# Altium project Quasar ARM.PrjPcb
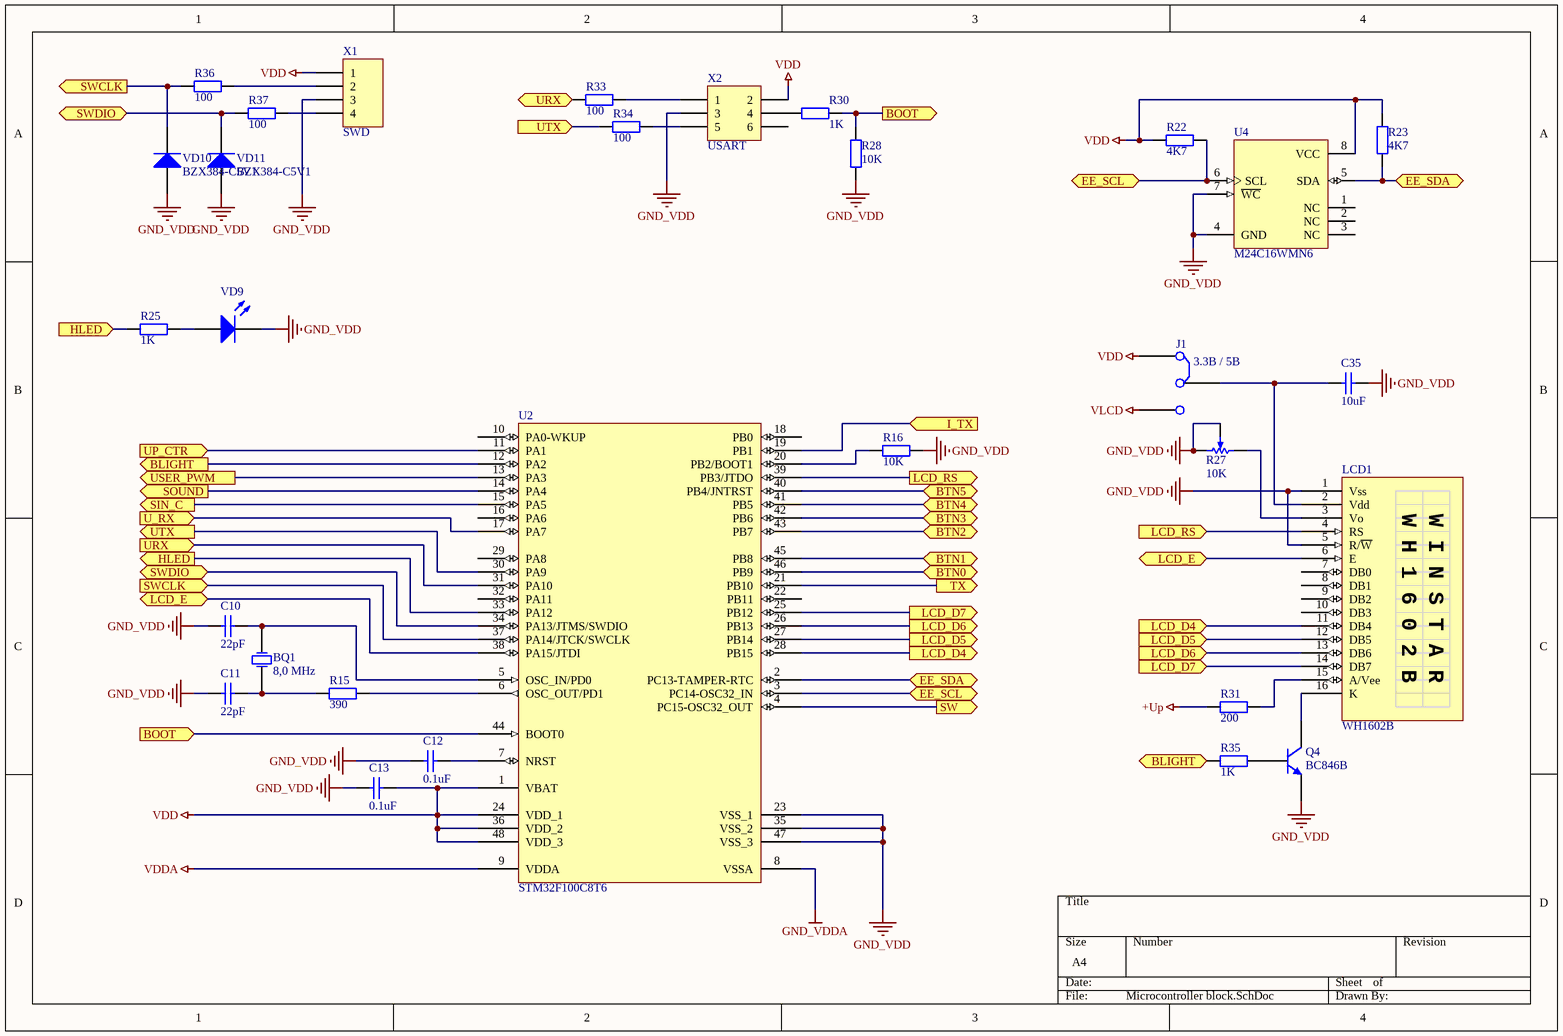
[diagram p0: Microcontroller block.SchDoc]
7 sheets, 157 parts. Net scope: flat (ports and power ports of the same name join across sheets).
Board files: pechatka.PcbDoc, pechatka_100x60.PcbDoc, pechatka_100x60_fabric.PcbDoc, pechatka_100x60_fabric_v2.PcbDoc, Integrator.PcbDoc, CoilOrganiser.PcbDoc
Sheets:
  Microcontroller block.SchDoc
  Power block.SchDoc
  Transmitter.SchDoc
  SoundBlock.SchDoc
  ReceiverBlock.SchDoc
  Keyboard_on_board.SchDoc
  Integrator.SchDoc

## Sheet Microcontroller block.SchDoc
size A4

### Parts
BQ1  8,0 MHz  [HC-49/U3H (low profile)]
C10  22pF  [0805]
C11  22pF  [0805]
C12  0.1uF  [0805]
C13  0.1uF  [1206_SMD_Capacitor]
C35  10uF  [1206_SMD_Capacitor]
J1  3.3В / 5В  [1206_SMD_JUMPER SELECTOR]
LCD1  WH1602B  [WS1602B-3]
Q4  BC846B  [SOT23_N]
R15  390  [1206_SMD_Resistor]
R16  10K  [1206_SMD_Resistor]
R22  4K7  [1206_SMD_Resistor]
R23  4K7  [1206_SMD_Resistor]
R25  1K  [1206_SMD_Resistor]
R27  10K  [3362P]
R28  10K  [1206_SMD_Resistor]
R30  1K  [1206_SMD_Resistor]
R31  200  [1206_SMD_Resistor]
R33  100  [1206_SMD_Resistor]
R34  100  [1206_SMD_Resistor]
R35  1K  [1206_SMD_Resistor]
R36  100  [1206_SMD_Resistor]
R37  100  [1206_SMD_Resistor]
U2  STM32F100C8T6  [LQFP-48_L]
U4  M24C16WMN6  [SO-8]
VD9  LED0  [1206_SMD_Resistor]  (value not drawn)
VD10  BZX384-C5V1  [SOD323]
VD11  BZX384-C5V1  [SOD323]
X1  SWD  [HDR1X4]
X2  USART  [HDR2X3]

### Ports
BLIGHT (in), BLIGHT (out), BOOT (in), BOOT (out), BTN0 (bidir), BTN1 (bidir), BTN2 (bidir), BTN3 (bidir), BTN4 (bidir), BTN5 (bidir), EE_SCL (bidir), EE_SDA (bidir), HLED (in), HLED (out), I_TX (in), LCD_D4 (in), LCD_D4 (out), LCD_D5 (in), LCD_D5 (out), LCD_D6 (in), LCD_D6 (out), LCD_D7 (in), LCD_D7 (out), LCD_E, LCD_E (bidir), LCD_RS (in), LCD_RS (out), SIN_C (out), SOUND (out), SW (out), SWCLK (in), SWCLK (out), SWDIO (bidir), TX (out), U_RX (in), UP_CTR (in), URX (in), URX (out), USER_PWM (out), UTX (in), UTX (out)

### Nets
+Up: R31.1
GND_VDD: C10.1 C11.1 C12.1 C13.1 C35.2 LCD1.1(Vss) LCD1.5(R/~{W}) Q4.2(E) R16.2 R27.1 R27.2 R28.1 U2.23(VSS_1) U2.35(VSS_2) U2.47(VSS_3) U4.4(GND) U4.7(~{WC}) VD9.2(K) VD10.1(A) VD11.1(A) X1.3 X2.3
GND_VDDA: U2.8(VSSA)
VDD: C13.2 J1.1 R22.1 R23.2 U2.1(VBAT) U2.24(VDD_1) U2.36(VDD_2) U2.48(VDD_3) U4.8(VCC) X1.1 X2.2
VDDA: U2.9(VDDA)
VLCD: J1.2
BTN0: U2.46(PB9) ; port BTN0
BTN1: U2.45(PB8) ; port BTN1
BTN2: U2.43(PB7) ; port BTN2
BTN3: U2.42(PB6) ; port BTN3
BTN4: U2.41(PB5) ; port BTN4
BTN5: U2.40(PB4/JNTRST) ; port BTN5
I_TX: U2.19(PB1) ; port I_TX
SIN_C: U2.15(PA5) ; port SIN_C
TX: U2.21(PB10) ; port TX
U_RX: U2.17(PA7) ; port U_RX
NetBQ1_1: BQ1.1(OSC1) C11.2 R15.1
NetBQ1_2: BQ1.2(OSC2) C10.2 U2.5(OSC_IN/PD0)
NetC12_2: C12.2 U2.7(NRST)
NetC19_2: U2.11(PA1) ; port UP_CTR
NetC31_1: U2.14(PA4) ; port SOUND
NetC35_1: C35.1 J1.0 LCD1.2(Vdd)
NetLCD1_3: LCD1.3(Vo) R27.3
NetLCD1_4: LCD1.4(RS) U2.39(PB3/JTDO) ; port LCD_RS
NetLCD1_6: LCD1.6(E) U2.38(PA15/JTDI) ; port LCD_E
NetLCD1_11: LCD1.11(DB4) U2.28(PB15) ; port LCD_D4
NetLCD1_12: LCD1.12(DB5) U2.27(PB14) ; port LCD_D5
NetLCD1_13: LCD1.13(DB6) U2.26(PB13) ; port LCD_D6
NetLCD1_14: LCD1.14(DB7) U2.25(PB12) ; port LCD_D7
NetLCD1_15: LCD1.15(A/Vee) R31.2
NetLCD1_16: LCD1.16(K) Q4.3(C)
NetQ4_1: Q4.1(B) R35.2
NetR15_2: R15.2 U2.6(OSC_OUT/PD1)
NetR16_1: R16.1 U2.20(PB2/BOOT1)
NetR22_2: R22.2 U2.3(PC14-OSC32_IN) U4.6(SCL) ; port EE_SCL
NetR23_1: R23.1 U2.2(PC13-TAMPER-RTC) U4.5(SDA) ; port EE_SDA
NetR25_1: R25.1 VD9.1(A)
NetR25_2: R25.2 U2.33(PA12) ; port HLED
NetR28_2: R28.2 R30.2 U2.44(BOOT0) ; port BOOT
NetR30_1: R30.1 X2.4
NetR33_1: R33.1 U2.31(PA10) ; port URX
NetR33_2: R33.2 X2.1
NetR34_1: R34.1 U2.30(PA9) ; port UTX
NetR34_2: R34.2 X2.5
NetR35_1: R35.1 U2.12(PA2) ; port BLIGHT
NetR36_1: R36.1 U2.37(PA14/JTCK/SWCLK) VD10.3(K) ; port SWCLK
NetR36_2: R36.2 X1.2
NetR37_1: R37.1 U2.34(PA13/JTMS/SWDIO) VD11.3(K) ; port SWDIO
NetR37_2: R37.2 X1.4
NetR47_1: U2.13(PA3) ; port USER_PWM
NetU2_4: U2.4(PC15-OSC32_OUT) ; port SW

Not connected (* = marked no-connect by the designer): LCD1 7(DB0) 8(DB1) 9(DB2) 10(DB3); U2 10(PA0-WKUP) 16(PA6) 18(PB0) 22(PB11) 29(PA8) 32(PA11); U4 1(NC) 2(NC) 3(NC); X2 6

### Notes on the sheet
- (in symbol WH1602B) W H 1 6 0 2 B; W I N S T A R

### Library data of the parts
BQ1 = XTAL: Crystal Oscillator; Published: 8-Jun-2000; LatestRevisionDate: 17-Jul-2002; LatestRevisionNote: Re-released for DXP Platform.; PackageReference: R38; Publisher: Altium Limited; PackageDescription: Crystal, Thru-Hole; 2 Leads; Body 3.1 x 8.2 mm (Dia.xH); Frequence: 8,0 MHz
C10-C13 C35 = Capacitor SMD: Capacitor; Published: 8-Jun-2000; LatestRevisionDate: 17-Jul-2002; LatestRevisionNote: Re-released for DXP Platform.; PackageReference: RAD-0.3; Publisher: Altium Limited
  C10 C11: Value: 22pF
  C12 C13: Value: 0.1uF
  C35: Value: 10uF
J1 = Jump Selector
LCD1 = WH1602B: Символьный ЖКИ разрешением 16 символов на 2 строки
Q4 = BC846B: NPN General-purpose Transistor; Published: 17-Sep-2003; LatestRevisionDate: 12-Dec-2006; LatestRevisionNote: IPC-7351 Footprint Added.; DatasheetVersion: 4-Feb-2002; PackageVersion: May-1999; PackageReference: SOT23; Publisher: Altium Limited; PackageDescription: 3-Pin SOT-23 Package 0.95 mm Pitch, 2.3 mm Lead Span; ComponentLink1Description: Manufacturer Link; ComponentLink1URL: http://www.semiconductors.philips.com/; ComponentLink2Description: Datasheet; ComponentLink2URL: http://www.semiconductors.philips.com/acrobat/datasheets/BC846_BC847_BC848_5.pdf
R15 R16 R22 R23 R25 R28 R30 R31 R33-R37 = Resistor: Published: 8-Jun-2000; LatestRevisionDate: 17-Jul-2002; LatestRevisionNote: Re-released for DXP Platform.; PackageReference: AXIAL-0.4; Publisher: Altium Limited; PackageDescription: Axial Device, Thru-Hole; 2 Leads; 0.4 in Pin Spacing
  R15: Value: 390
  R16 R28: Value: 10K
  R22 R23: Value: 4K7
  R25 R30 R35: Value: 1K
  R31: Value: 200
  R33 R34 R36 R37: Value: 100
R27 = Trimming Potentiometer: Square Trimming Potentiometer; Published: 17-Dec-2003; DatasheetVersion: Oct-2003; PackageReference: POT4MM-2; Publisher: Altium Limited; PackageDescription: Square Trimming Potentiometer; ComponentLink1Description: Manufacturer Link; ComponentLink1URL: http://bourns.com/2/search.html; Value: 10K
U2 = STM32F101C8T6: STM32 ARM-based 32-bit MCU with 64 Kbytes Flash, 48-pin LQFP, Industrial Temperature; Published: 30-May-2008; DatasheetVersion: rev6, Mar-2008; PackageVersion: Mar-2008; PackageReference: LQFP48; Publisher: Altium Limited; PackageDescription: 48-Pin Low-Profile Quad Flat Pack, 7 x 7 mm Body, 0.5 mm Pitch (LQFP48); ComponentLink1Description: Manufacturer Link; ComponentLink1URL: www.st.com/stm32; ComponentLink2Description: Datasheet; ComponentLink2URL: http://www.st.com/stonline/products/literature/ds/13586.pdf
U4 = M24C16WMN6: 16Kbit Serial IІC Bus EEPROM; Published: 24-Aug-2001; LatestRevisionDate: 13-Apr-2006; LatestRevisionNote: IPC-7351 Footprint Added.; DatasheetVersion: Sep-1999; PackageVersion: Jul-1999; PackageReference: SOP8; Publisher: Altium Limited; PackageDescription: 8-Pin Small Outline Integrated Circuit 1.27 mm Pitch; ComponentLink1Description: Manufacturer Link; ComponentLink1URL: http://www.st.com/; ComponentLink2Description: Datasheet; ComponentLink2URL: http://www.st.com/stonline/products/literature/ds/5067/m24c01-r.pdf
VD9 = LED0: Typical INFRARED GaAs LED; Published: 8-Jun-2000; LatestRevisionDate: 08-Jul-2005; LatestRevisionNote: Mech Layer 1 removed.; PackageReference: LED-0; Publisher: Altium Limited; PackageDescription: LED; 2 Leads
VD10 VD11 = BZX84-C5V1: Voltage Regulator Diode; pin to pad: 3>2; Note: Pin 2 is not connected and not drawn; Published: 17-Sep-2003; LatestRevisionDate: 12-Dec-2006; LatestRevisionNote: IPC-7351 Footprint Added.; DatasheetVersion: 18-May-1999; PackageVersion: May-1999; PackageReference: SOT23; Publisher: Altium Limited; PackageDescription: 3-Pin SOT-23 Package 0.95 mm Pitch, 2.3 mm Lead Span; ComponentLink1Description: Manufacturer Link; ComponentLink1URL: http://www.semiconductors.philips.com/; ComponentLink2Description: Datasheet; ComponentLink2URL: http://www.semiconductors.philips.com/acrobat/datasheets/BZX84_SERIES_3.pdf
X1 = Header 4: Header, 4-Pin; LatestRevisionDate: 17-Jul-2002; LatestRevisionNote: Re-released for DXP Platform.; Publisher: Altium Limited
X2 = Header 3X2: Header, 3-Pin, Dual row; LatestRevisionDate: 17-Jul-2002; LatestRevisionNote: Re-released for DXP Platform.; Publisher: Altium Limited

## Sheet Power block.SchDoc
size A4
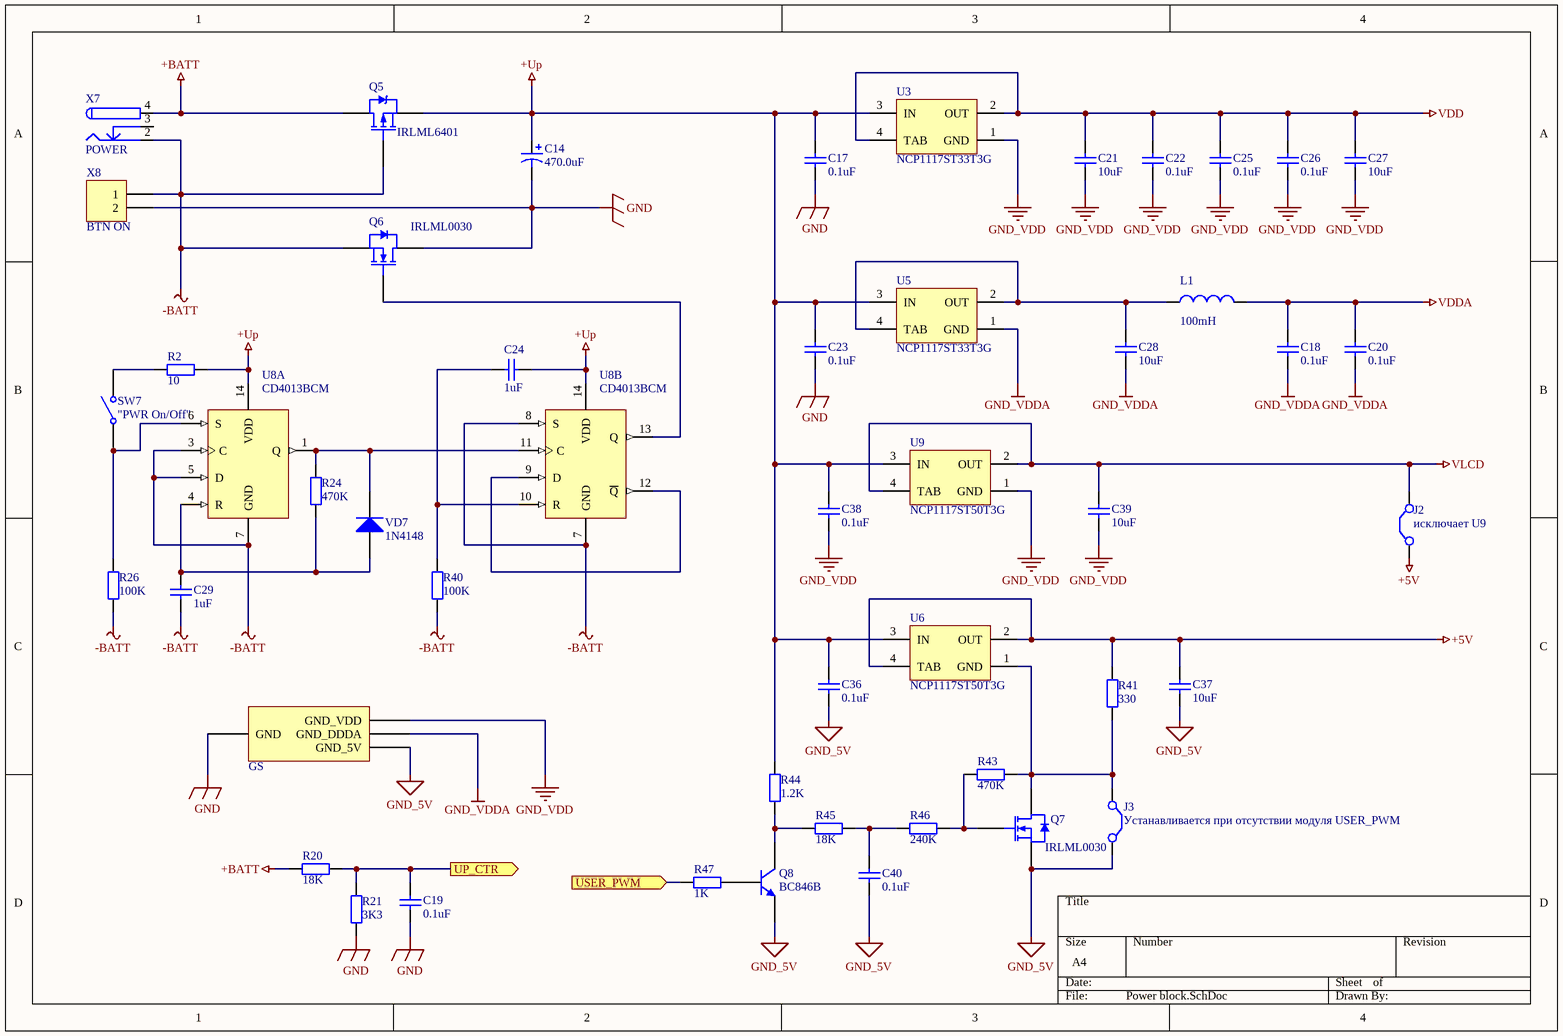
[diagram p1: Power block.SchDoc]

### Parts
C14  470.0uF  [Capacitor-10x12.5-lyingR]
C17  0.1uF  [1206_SMD_Capacitor]
C18  0.1uF  [1206_SMD_Capacitor]
C19  0.1uF  [1206_SMD_Capacitor]
C20  0.1uF  [1206_SMD_Capacitor]
C21  10uF  [1206_SMD_Capacitor]
C22  0.1uF  [0805]
C23  0.1uF  [1206_SMD_Capacitor]
C24  1uF  [1206_SMD_Capacitor]
C25  0.1uF  [0805]
C26  0.1uF  [0805]
C27  10uF  [1206_SMD_Capacitor]
C28  10uF  [1206_SMD_Capacitor]
C29  1uF  [1206_SMD_Capacitor]
C36  0.1uF  [1206_SMD_Capacitor]
C37  10uF  [1206_SMD_Capacitor]
C38  0.1uF  [1206_SMD_Capacitor]
C39  10uF  [1206_SMD_Capacitor]
C40  0.1uF  [1206_SMD_Capacitor]
GS  Ground setter  [GND_POINT]  (value not drawn)  (net tie, no BOM)
J2  исключает U9  [1206_SMD_JUMPER]
J3  Устанавливается при отсутствии модуля USER_PWM  [1206_SMD_Resistor]
L1  value 100mH  [1210]  (hidden comment: Inductor)
Q5  IRLML6401  [SOT23_N]
Q6  IRLML0030  [SOT23_N]
Q7  IRLML0030  [SOT23_N]
Q8  BC846B  [SOT23_N]
R2  10  [1206_SMD_Resistor]
R20  18K  [1206_SMD_Resistor]
R21  3K3  [1206_SMD_Resistor]
R24  470K  [1206_SMD_Resistor]
R26  100K  [1206_SMD_Resistor]
R40  100K  [1206_SMD_Resistor]
R41  330  [1206_SMD_Resistor]
R43  470K  [1206_SMD_Resistor]
R44  1.2K  [1206_SMD_Resistor]
R45  18K  [1206_SMD_Resistor]
R46  240K  [1206_SMD_Resistor]
R47  1K  [1206_SMD_Resistor]
SW7  "PWR On/Off"  [KAN1211]
U3  NCP1117ST33T3G  [SOT-223]
U5  NCP1117ST33T3G  [SOT-223]
U6  NCP1117ST50T3G  [SOT-223]
U8  CD4013BCM  [M14A_M]  (parts A,B of 2)
U9  NCP1117ST50T3G  [SOT-223]
VD7  1N4148  [SOD-323]
X7  POWER  [DC-044]
X8  BTN ON  [HDR1X2]

### Ports
UP_CTR (out), USER_PWM (in)

### Nets
+5V: C37.2 J2.1(C1) R41.2 U6.2(OUT) U6.4(TAB)
+BATT: Q5.3(D) R20.1 X7.4
+Up: C14.1 C17.2 C23.2 C24.2 C36.2 C38.2 Q5.2(S) R2.2 R44.2 U3.3(IN) U5.3(IN) U6.3(IN) U8.14(VDD) U9.3(IN)
-BATT: C29.1 Q5.1(G) Q6.2(S) R26.1 R40.1 U8.3(C) U8.5(D) U8.7(GND) U8.8(S) X7.2 X8.1
GND: C14.2 C17.1 C19.1 C23.1 GS.1(GND) Q6.3(D) R21.1 X8.2
GND_5V: C36.1 C37.1 C40.1 GS.4(GND_5V) J3.2(C2) Q7.2(S) Q8.2(E)
GND_VDD: C21.1 C22.1 C25.1 C26.1 C27.1 C38.1 C39.1 GS.2(GND_VDD) U3.1(GND) U9.1(GND)
GND_VDDA: C18.1 C20.1 C28.1 GS.3(GND_DDDA) U5.1(GND)
VDD: C21.2 C22.2 C25.2 C26.2 C27.2 U3.2(OUT) U3.4(TAB)
VDDA: C18.2 C20.2 L1.2
VLCD: C39.2 J2.2(C2) U9.2(OUT) U9.4(TAB)
NetC19_2: C19.2 R20.2 R21.2 ; port UP_CTR
NetC24_1: C24.1 R40.2 U8.10(R)
NetC28_2: C28.2 L1.1 U5.2(OUT) U5.4(TAB)
NetC29_2: C29.2 R24.1 U8.4(R) VD7.1(A)
NetC40_2: C40.2 R45.2 R46.1
NetJ3_1: J3.1(C1) Q7.3(D) R41.1 R43.1 U6.1(GND)
NetQ6_1: Q6.1(G) U8.13(Q)
NetQ7_1: Q7.1(G) R43.2 R46.2
NetQ8_1: Q8.1(B) R47.2
NetQ8_3: Q8.3(C) R44.1 R45.1
NetR2_1: R2.1 SW7.2(NO)
NetR24_2: R24.2 U8.1(Q) U8.11(C) VD7.2(K)
NetR26_2: R26.2 SW7.1(COMMON) U8.6(S)
NetR47_1: R47.1 ; port USER_PWM
NetU8_9: U8.9(D) U8.12(~{Q})

Not connected (* = marked no-connect by the designer): U8 2(~{Q}); X7 3

### Library data of the parts
C14 = Cap Pol1: Polarized Capacitor (Radial); Published: 8-Jun-2000; LatestRevisionDate: 17-Jul-2002; LatestRevisionNote: Re-released for DXP Platform.; PackageReference: RB7.6-15; Publisher: Altium Limited; PackageDescription: Polarized Capacitor (Radial); 2 Leads; Value: 470.0uF
C17-C29 C36-C40 = Capacitor SMD: Capacitor; Published: 8-Jun-2000; LatestRevisionDate: 17-Jul-2002; LatestRevisionNote: Re-released for DXP Platform.; PackageReference: RAD-0.3; Publisher: Altium Limited
  C17-C20 C22 C23 C25 C26 C36 C38 C40: Value: 0.1uF
  C21 C27 C28 C37 C39: Value: 10uF
  C24 C29: Value: 1uF
GS = Ground setter: pin to pad: 3>4 4>3
J2 J3 = Jumper: Jumper Wire; Published: 24-Mar-1999; LatestRevisionDate: 17-Jul-2002; LatestRevisionNote: Re-released for DXP Platform.; PackageReference: RAD-0.2; Publisher: Altium Limited; PackageDescription: Radial Cap, Thru-Hole; 2 Leads; 0.2 in Pin Spacing
L1 = Inductor: Code_IEC: 1005; Published: 8-Jun-2000; LatestRevisionDate: 29-May-2009; LatestRevisionNote: IPC-7351 Footprint Added.; PackageReference: 0402-A; Publisher: Altium Limited; PackageDescription: Chip Inductor; Code_JEITA: 0402
Q5 = IRLML6401: HEXFET Power MOSFET; Published: 17-Sep-2003; DatasheetVersion: 2-Jul-2001; PackageVersion: Jul-2001; PackageReference: Micro3; Publisher: Altium Limited; PackageDescription: 3-Pin SOT-23 Package 0.95 mm Pitch, 2.3 mm Lead Span; ComponentLink1Description: Manufacturer Link; ComponentLink1URL: http://www.irf.com/; ComponentLink2Description: Datasheet; ComponentLink2URL: http://www.irf.com/product-info/datasheets/data/IRLML6401.pdf
Q6 Q7 = 2N7002: HEXFET Power MOSFET; Published: 17-Sep-2003; DatasheetVersion: 2-Jul-2001; PackageVersion: Jul-2001; PackageReference: Micro3; Publisher: Altium Limited; PackageDescription: 3-Pin SOT-23 Package 0.95 mm Pitch, 2.3 mm Lead Span; ComponentLink1Description: Manufacturer Link; ComponentLink1URL: http://www.irf.com/; ComponentLink2Description: Datasheet; ComponentLink2URL: http://www.irf.com/product-info/datasheets/data/IRLML6401.pdf
Q8 = BC846B: NPN General-purpose Transistor; Published: 17-Sep-2003; LatestRevisionDate: 12-Dec-2006; LatestRevisionNote: IPC-7351 Footprint Added.; DatasheetVersion: 4-Feb-2002; PackageVersion: May-1999; PackageReference: SOT23; Publisher: Altium Limited; PackageDescription: 3-Pin SOT-23 Package 0.95 mm Pitch, 2.3 mm Lead Span; ComponentLink1Description: Manufacturer Link; ComponentLink1URL: http://www.semiconductors.philips.com/; ComponentLink2Description: Datasheet; ComponentLink2URL: http://www.semiconductors.philips.com/acrobat/datasheets/BC846_BC847_BC848_5.pdf
R2 R20 R21 R24 R26 R40 R41 R43-R47 = Resistor
  R2: Published: 31-Aug-2014; Publisher: Dmitry Kuzmin; Value: 10
  R20: Published: 8-Jun-2000; LatestRevisionDate: 17-Jul-2002; LatestRevisionNote: Re-released for DXP Platform.; PackageReference: AXIAL-0.4; Publisher: Altium Limited; PackageDescription: Axial Device, Thru-Hole; 2 Leads; 0.4 in Pin Spacing; Value: 18K
  R21: Published: 8-Jun-2000; LatestRevisionDate: 17-Jul-2002; LatestRevisionNote: Re-released for DXP Platform.; PackageReference: AXIAL-0.4; Publisher: Altium Limited; PackageDescription: Axial Device, Thru-Hole; 2 Leads; 0.4 in Pin Spacing; Value: 3K3
  R24 R43: Published: 31-Aug-2014; Publisher: Dmitry Kuzmin; Value: 470K
  R26 R40: Published: 31-Aug-2014; Publisher: Dmitry Kuzmin; Value: 100K
  R41: Published: 31-Aug-2014; Publisher: Dmitry Kuzmin; Value: 330
  R44: Published: 31-Aug-2014; Publisher: Dmitry Kuzmin; Value: 1.2K
  R45: Published: 31-Aug-2014; Publisher: Dmitry Kuzmin; Value: 18K
  R46: Published: 31-Aug-2014; Publisher: Dmitry Kuzmin; Value: 240K
  R47: Published: 31-Aug-2014; Publisher: Dmitry Kuzmin; Value: 1K
SW7 = TACT Switch: Single-Pole, Single-Throw Switch; Published: 24-Mar-1999; LatestRevisionDate: 17-Jul-2002; LatestRevisionNote: Re-released for DXP Platform.; PackageReference: SPST-2; Publisher: Altium Limited; PackageDescription: Switch; 2 Leads
U3 U5 = NCP1117ST33: LDO стабилизатор 3.3 V, 1 A, падение 1.2 V, Uвх до 20 V, 0..+125°C, 1%; PartNumber: LM1117S-3.3; Manufacturer: National Semiconductor; PackageTopMarking: NSUZXYTTE#*LM1117S*3.3; CompType: LDO IC; Published: 4-Dec-2008; DatasheetVersion: Apr-2006; PackageVersion: revF, Apr-2005; PackageReference: TS3B; Publisher: Altium Limited; PackageDescription: TO-263, Molded, .400 x .390 x .180in, 3 Lead, .1in Pitch, Surface Mount; Supplier 1: Farnell; Supplier Part Number 1: 1652366; RoHS: O; PinCount: 3; Code_JEDEC: MO-169-AA; ComponentLink1Description: LM1117 Datasheet; ComponentLink1URL: http://www.national.com/ds/LM/LM1117.pdf; ComponentLink2Description: LM1117 Web Page; ComponentLink2URL: http://www.national.com/pf/LM/LM1117.html; ComponentLink3Description: TS3B Package Page; ComponentLink3URL: http://www.national.com/packaging/folders/ts3b.html; Supplier 2: Digi-Key; Supplier Part Number 2: NCP1117ST33T3GOSTR-ND
U6 U9 = NCP1117ST50: LDO стабилизатор 5.0 V, 1 A, падение 1.2 V, Uвх до 20 V, 0..+125°C, 1%; PartNumber: LM1117S-5.0; Manufacturer: National Semiconductor; PackageTopMarking: NSUZXYTTE#*LM1117S*5.0; CompType: LDO IC; Published: 4-Dec-2008; DatasheetVersion: Apr-2006; PackageVersion: revF, Apr-2005; PackageReference: TS3B; Publisher: Altium Limited; PackageDescription: TO-263, Molded, .400 x .390 x .180in, 3 Lead, .1in Pitch, Surface Mount; RoHS: Y; PinCount: 3; Code_JEDEC: MO-169-AA; ComponentLink1Description: LM1117 Datasheet; ComponentLink1URL: http://www.national.com/ds/LM/LM1117.pdf; ComponentLink2Description: LM1117 Web Page; ComponentLink2URL: http://www.national.com/pf/LM/LM1117.html; ComponentLink3Description: TS3B Package Page; ComponentLink3URL: http://www.national.com/packaging/folders/ts3b.html; Supplier 1: Digi-Key; Supplier Part Number 1: NCP1117ST50T3GOSTR-ND
U8 = CD4013BCM: Dual D-Type Flip-Flop; Published: 17-Jul-2002; LatestRevisionDate: 13-Apr-2006; LatestRevisionNote: IPC-7351 Footprint Added.; DatasheetVersion: Jan-1999; PackageVersion: 2000; PackageReference: M14A; Publisher: Altium Limited; PackageDescription: 14-Pin Small Outline Integrated Circuit 1.27 mm Pitch; Code_IPC: SOIC127P600-14; ComponentLink1Description: Manufacturer Link; ComponentLink1URL: http://www.fairchildsemi.com/
VD7 = 1N4148: High Conductance Fast Diode; Published: 8-Jun-2000; LatestRevisionDate: 17-Jul-2002; LatestRevisionNote: Re-released for DXP Platform.; DatasheetDocument: 1997; PackageReference: DO-35; Publisher: Altium Limited; Code_JEDEC: DO-204-AH; ComponentLink1Description: Manufacturer Link; ComponentLink1URL: http://www.fairchildsemi.com/; ComponentLink2Description: Datasheet; ComponentLink2URL: http://www.fairchildsemi.com/ds/1N%2F1N4148.pdf
X7 = DC-044: Low Voltage Power Supply Connector; Published: 17-Dec-2003; DatasheetDocument: 09-May-2002; Publisher: Altium Limited; ComponentLink1Description: Manufacturer Link; ComponentLink1URL: http://domino.kycon.com/internet/Products.html
X8 = Header 2: Header, 2-Pin; LatestRevisionDate: 17-Jul-2002; LatestRevisionNote: Re-released for DXP Platform.; Publisher: Altium Limited

## Sheet Transmitter.SchDoc
size A4
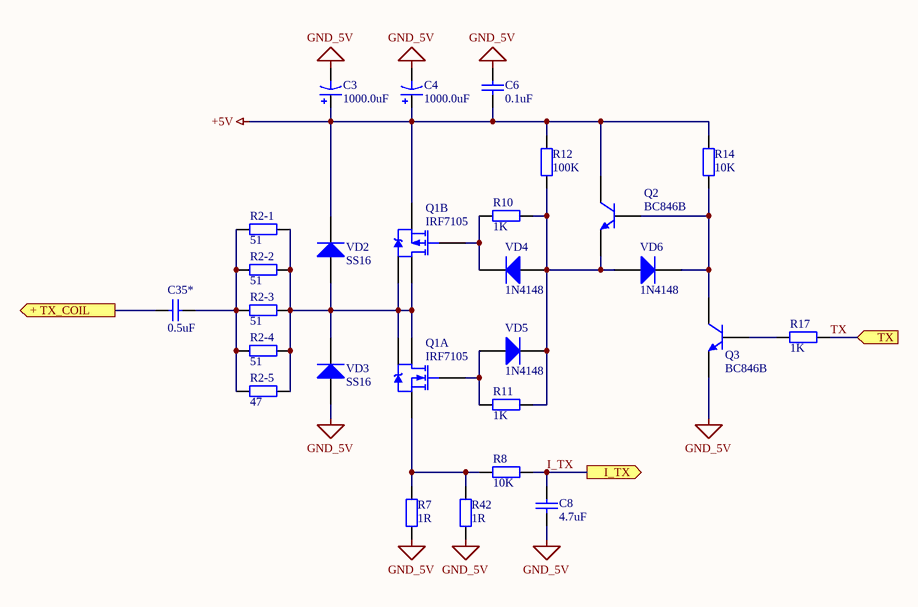
[diagram p2: Transmitter.SchDoc]

### Parts
C3  1000.0uF  [Capacitor-10X20-LYINGR]
C4  1000.0uF  [Capacitor-10X20-LYINGR]
C6  0.1uF  [1206_SMD_Capacitor]
C8  4.7uF  [1206_SMD_Capacitor]
C35*  0.5uF  [K71-7-LYING]
Q1  IRF7105  [SO-2]  (parts A,B of 2)
Q2  BC846B  [SOT23_N]
Q3  BC846B  [SOT23_N]
R2-1  51  [1206_SMD_Resistor]
R2-2  51  [1206_SMD_Resistor]
R2-3  51  [1206_SMD_Resistor]
R2-4  51  [1206_SMD_Resistor]
R2-5  47  [1206_SMD_Resistor]
R7  1R  [1206_SMD_Resistor]
R8  10K  [1206_SMD_Resistor]
R10  1K  [1206_SMD_Resistor]
R11  1K  [1206_SMD_Resistor]
R12  100K  [1206_SMD_Resistor]
R14  10K  [1206_SMD_Resistor]
R17  1K  [1206_SMD_Resistor]
R42  1R  [1206_SMD_Resistor]
VD2  SS16  [SMA]
VD3  SS16  [SMA]
VD4  1N4148  [SOD-323]
VD5  1N4148  [SOD-323]
VD6  1N4148  [SOD-323]

### Ports
+ TX_COIL (out), I_TX (out), TX (in)

### Nets
+5V: C3.1 C4.1 C6.1 Q1.3(S) Q2.3(C) R12.2 R14.2 VD2.2(K)
GND_5V: C3.2 C4.2 C6.2 C8.1 Q3.2(E) R7.2 R42.2 VD3.1(A)
I_TX: C8.2 R8.1 ; port I_TX
TX: R17.2 ; port TX
NetC35*_1: C35*.1 ; port + TX_COIL
NetC35*_2: C35*.2 R2-1.1 R2-2.1 R2-3.1 R2-4.1 R2-5.1
NetQ1_1: Q1.1(S) R7.1 R8.2 R42.1
NetQ1_2: Q1.2(G) R11.2 VD5.1(A)
NetQ1_4: Q1.4(G) R10.2 VD4.2(K)
NetQ1_5: Q1.5(D) Q1.6 Q1.7(D) Q1.8 R2-1.2 R2-2.2 R2-3.2 R2-4.2 R2-5.2 VD2.1(A) VD3.2(K)
NetQ2_1: Q2.1(B) Q3.3(C) R14.1 VD6.2(K)
NetQ2_2: Q2.2(E) R10.1 R11.1 R12.1 VD4.1(A) VD5.2(K) VD6.1(A)
NetQ3_1: Q3.1(B) R17.1

### Library data of the parts
C3 C4 = Cap Pol1: Polarized Capacitor (Radial); Published: 8-Jun-2000; LatestRevisionDate: 17-Jul-2002; LatestRevisionNote: Re-released for DXP Platform.; PackageReference: RB7.6-15; Publisher: Altium Limited; PackageDescription: Polarized Capacitor (Radial); 2 Leads; Value: 1000.0uF
C6 C8 = Capacitor SMD: Capacitor; Published: 8-Jun-2000; LatestRevisionDate: 17-Jul-2002; LatestRevisionNote: Re-released for DXP Platform.; PackageReference: RAD-0.3; Publisher: Altium Limited
  C6: Value: 0.1uF
  C8: Value: 4.7uF
C35* = Capacitor K71-7: Capacitor; Published: 8-Jun-2000; LatestRevisionDate: 17-Jul-2002; LatestRevisionNote: Re-released for DXP Platform.; PackageReference: RAD-0.3; Publisher: Altium Limited; Value: 0.5uF
Q2 Q3 = BC846B: NPN General-purpose Transistor; Published: 17-Sep-2003; LatestRevisionDate: 12-Dec-2006; LatestRevisionNote: IPC-7351 Footprint Added.; DatasheetVersion: 4-Feb-2002; PackageVersion: May-1999; PackageReference: SOT23; Publisher: Altium Limited; PackageDescription: 3-Pin SOT-23 Package 0.95 mm Pitch, 2.3 mm Lead Span; ComponentLink1Description: Manufacturer Link; ComponentLink1URL: http://www.semiconductors.philips.com/; ComponentLink2Description: Datasheet; ComponentLink2URL: http://www.semiconductors.philips.com/acrobat/datasheets/BC846_BC847_BC848_5.pdf
R2-1-R2-5 R7 R8 R10-R12 R14 R17 R42 = Resistor: Published: 8-Jun-2000; LatestRevisionDate: 17-Jul-2002; LatestRevisionNote: Re-released for DXP Platform.; PackageReference: AXIAL-0.4; Publisher: Altium Limited; PackageDescription: Axial Device, Thru-Hole; 2 Leads; 0.4 in Pin Spacing
  R2-1-R2-4: Value: 51
  R2-5: Value: 47
  R7 R42: Value: 1R
  R8 R14: Value: 10K
  R10 R11 R17: Value: 1K
  R12: Value: 100K
VD2 VD3 = Diode: Default Diode; Published: 8-Jun-2000; LatestRevisionDate: 17-Jul-2002; LatestRevisionNote: Re-released for DXP Platform.; PackageVersion: Sep-1996; PackageReference: SMC; Publisher: Altium Limited; PackageDescription: DO-214-AB/SMC; 2 C-Bend Leads; Body 7.9 x 5.9 mm, inc. leads (LxW); Code_JEDEC: DO-214-AB
VD4-VD6 = 1N4148: High Conductance Fast Diode; Published: 8-Jun-2000; LatestRevisionDate: 17-Jul-2002; LatestRevisionNote: Re-released for DXP Platform.; DatasheetDocument: 1997; PackageReference: DO-35; Publisher: Altium Limited; Code_JEDEC: DO-204-AH; ComponentLink1Description: Manufacturer Link; ComponentLink1URL: http://www.fairchildsemi.com/; ComponentLink2Description: Datasheet; ComponentLink2URL: http://www.fairchildsemi.com/ds/1N%2F1N4148.pdf

## Sheet SoundBlock.SchDoc
size A4
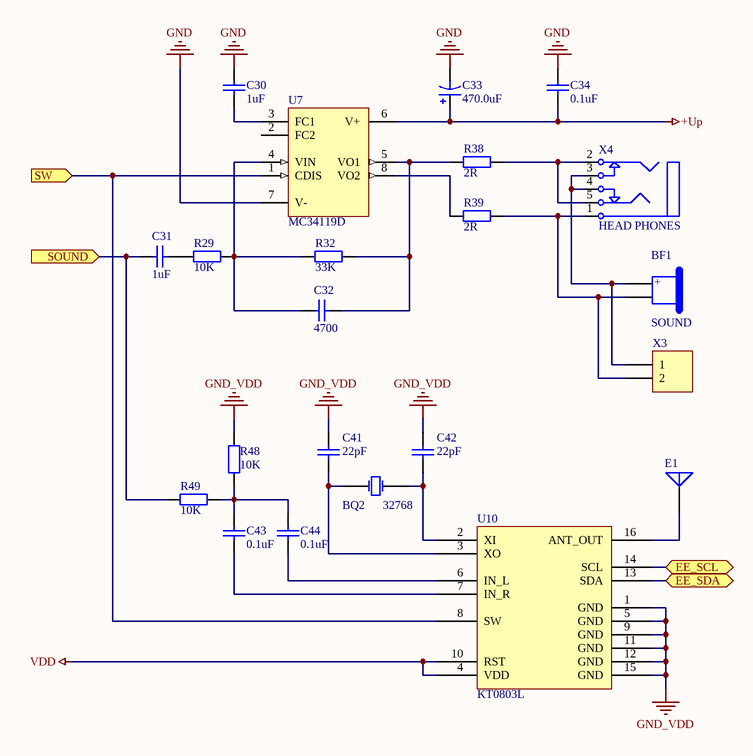
[diagram p3: SoundBlock.SchDoc]

### Parts
BF1  SOUND  [HCM12A]
BQ2  32768  [HC-49/U3H (low profile)]
C30  1uF  [1206_SMD_Capacitor]
C31  1uF  [1206_SMD_Capacitor]
C32  4700  [1206_SMD_Capacitor]
C33  470.0uF  [E]
C34  0.1uF  [1206_SMD_Capacitor]
C41  22pF  [0805]
C42  22pF  [0805]
C43  0.1uF  [0805]
C44  0.1uF  [0805]
E1  Antenna  [PIN1]  (value not drawn)
R29  10K  [1206_SMD_Resistor]
R32  33K  [1206_SMD_Resistor]
R38  2R  [1206_SMD_Resistor]
R39  2R  [1206_SMD_Resistor]
R48  10K  [1206_SMD_Resistor]
R49  10K  [1206_SMD_Resistor]
U7  MC34119D  [SO-8]
U10  KT0803L  [SOIC16N_M]
X3  SOUND  [HDR1X2]  (value not drawn)
X4  HEAD PHONES  [Audio from Aliexpress]

### Ports
EE_SCL (bidir), EE_SDA, SOUND (in), SW (in)

### Nets
+Up: C33.1 C34.1 U7.6(V+)
GND: C30.1 C33.2 C34.2 U7.7(V-)
GND_VDD: C41.2 C42.2 R48.2 U10.1(GND) U10.5(GND) U10.9(GND) U10.11(GND) U10.12(GND) U10.15(GND)
VDD: U10.4(VDD) U10.10(RST)
NetBF1_1: BF1.1 X3.1 X4.3 X4.4
NetBF1_2: BF1.2 R39.2 X3.2 X4.1
NetBQ2_1: BQ2.1(OSC1) C42.1 U10.2(XI)
NetBQ2_2: BQ2.2(OSC2) C41.1 U10.3(XO)
NetC30_2: C30.2 U7.3(FC1)
NetC31_1: C31.1 R49.1 ; port SOUND
NetC31_2: C31.2 R29.1
NetC32_1: C32.1 R29.2 R32.1 U7.4(VIN)
NetC32_2: C32.2 R32.2 R38.1 U7.5(VO1)
NetC43_1: C43.1 U10.7(IN_R)
NetC43_2: C43.2 C44.2 R48.1 R49.2
NetC44_1: C44.1 U10.6(IN_L)
NetE1_1: E1.1(A) U10.16(ANT_OUT)
NetR22_2: U10.14(SCL) ; port EE_SCL
NetR23_1: U10.13(SDA) ; port EE_SDA
NetR38_2: R38.2 X4.2 X4.5
NetR39_1: R39.1 U7.8(VO2)
NetU2_4: U7.1(CDIS) U10.8(SW) ; port SW

Not connected (* = marked no-connect by the designer): U7 2(FC2)

### Notes on the sheet
- (in symbol Elrctro-Magnetic Sound Generator) +

### Library data of the parts
BF1 = Elrctro-Magnetic Sound Generator: Magnetic Transducer Buzzer; Published: 24-Mar-1999; LatestRevisionDate: 17-Dec-2003; LatestRevisionNote: Schematic revised, PCB Footprint replaced.; DatasheetVersion: 17-Dec-2003; PackageReference: ABSM-1574; Publisher: Altium Limited; PackageDescription: Magnetic Transducer Buzzer; ComponentLink1Description: Manufacturer Link; ComponentLink1URL: http://www.megastar.com/linecard/buzzmode/index.php
BQ2 = XTAL: Crystal Oscillator; Frequence: 8,0 MHz; Published: 8-Jun-2000; LatestRevisionDate: 17-Jul-2002; LatestRevisionNote: Re-released for DXP Platform.; PackageReference: R38; Publisher: Altium Limited; PackageDescription: Crystal, Thru-Hole; 2 Leads; Body 3.1 x 8.2 mm (Dia.xH)
C30-C32 C34 C41-C44 = Capacitor SMD: Capacitor; Published: 8-Jun-2000; LatestRevisionDate: 17-Jul-2002; LatestRevisionNote: Re-released for DXP Platform.; PackageReference: RAD-0.3; Publisher: Altium Limited
  C30 C31: Value: 1uF
  C32: Value: 4700
  C34 C43 C44: Value: 0.1uF
  C41 C42: Value: 22pF
C33 = Cap Pol1: Polarized Capacitor (Radial); Published: 8-Jun-2000; LatestRevisionDate: 17-Jul-2002; LatestRevisionNote: Re-released for DXP Platform.; PackageReference: RB7.6-15; Publisher: Altium Limited; PackageDescription: Polarized Capacitor (Radial); 2 Leads; Value: 470.0uF
E1 = Antenna: Generic Antenna; Published: 24-Mar-1999; LatestRevisionDate: 17-Jul-2002; LatestRevisionNote: Re-released for DXP Platform.; PackageReference: PIN1; Publisher: Altium Limited
R29 R32 R38 R39 R48 R49 = Resistor
  R29: Published: 8-Jun-2000; LatestRevisionDate: 17-Jul-2002; LatestRevisionNote: Re-released for DXP Platform.; PackageReference: AXIAL-0.4; Publisher: Altium Limited; PackageDescription: Axial Device, Thru-Hole; 2 Leads; 0.4 in Pin Spacing; Value: 10K
  R32: Published: 8-Jun-2000; LatestRevisionDate: 17-Jul-2002; LatestRevisionNote: Re-released for DXP Platform.; PackageReference: AXIAL-0.4; Publisher: Altium Limited; PackageDescription: Axial Device, Thru-Hole; 2 Leads; 0.4 in Pin Spacing; Value: 33K
  R38 R39: Published: 8-Jun-2000; LatestRevisionDate: 17-Jul-2002; LatestRevisionNote: Re-released for DXP Platform.; PackageReference: AXIAL-0.4; Publisher: Altium Limited; PackageDescription: Axial Device, Thru-Hole; 2 Leads; 0.4 in Pin Spacing; Value: 2R
  R48 R49: Published: 31-Aug-2014; Publisher: Dmitry Kuzmin; Value: 10K
U7 = MC34119D: Low-Power Audio Amplifier; Published: 17-Jul-2002; LatestRevisionDate: 13-Apr-2006; LatestRevisionNote: IPC-7351 Footprint Added.; DatasheetVersion: 1989; PackageReference: 751-03; Publisher: Altium Limited; PackageDescription: 8-Pin Small Outline Integrated Circuit 1.27 mm Pitch; Code_JEDEC: MS-012-AA; Code_IPC: SOIC127P600-8
X3 = Header 2: Header, 2-Pin; LatestRevisionDate: 17-Jul-2002; LatestRevisionNote: Re-released for DXP Platform.; Publisher: Altium Limited
X4 = Phonejack Stereo SW: 3-Conductor Jack with 2 break contacts (normals) and 2 auxiliary make contacts; LatestRevisionDate: 17-Dec-2003; LatestRevisionNote: PCB Footprint replaced.; Publisher: Altium Limited; Published: 5-Jan-2004; DatasheetDocument: 07-Mar-2000; ComponentLink1Description: Manufacturer Link; ComponentLink1URL: http://domino.kycon.com/internet/Products.html

## Sheet ReceiverBlock.SchDoc
size A4
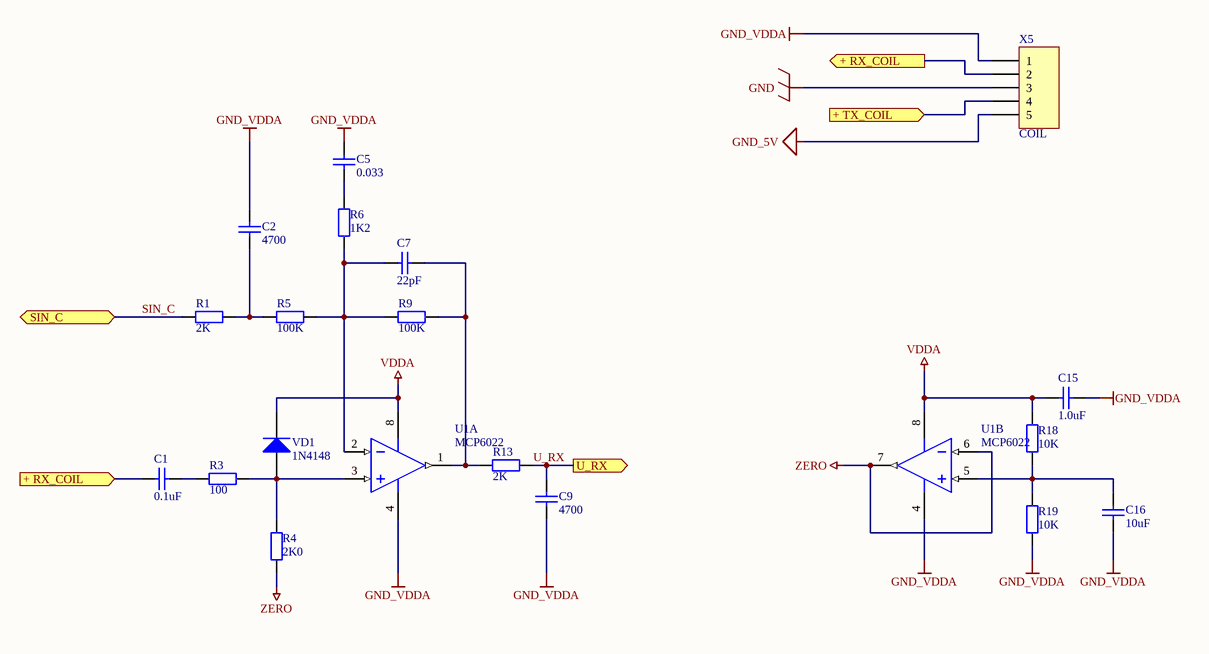
[diagram p4: ReceiverBlock.SchDoc]

### Parts
C1  0.1uF  [1206_SMD_Capacitor]
C2  4700  [1206_SMD_Capacitor]
C5  0.033  [1206_SMD_Capacitor]
C7  22pF  [1206_SMD_Capacitor]
C9  4700  [1206_SMD_Capacitor]
C15  1.0uF  [1206_SMD_Capacitor]
C16  10uF  [1206_SMD_Capacitor]
R1  2K  [1206_SMD_Resistor]
R3  100  [1206_SMD_Resistor]
R4  2K0  [1206_SMD_Resistor]
R5  100K  [1206_SMD_Resistor]
R6  1K2  [1206_SMD_Resistor]
R9  100K  [1206_SMD_Resistor]
R13  2K  [1206_SMD_Resistor]
R18  10K  [1206_SMD_Resistor]
R19  10K  [1206_SMD_Resistor]
U1  MCP6022  [SOIC-SN8_N]  (parts A,B of 2)
VD1  1N4148  [SOD-323]
X5  COIL  [GX16-5]

### Ports
+ RX_COIL (in), + RX_COIL (out), + TX_COIL (in), SIN_C, U_RX (out)

### Nets
GND: X5.3
GND_5V: X5.5
GND_VDDA: C2.1 C5.2 C9.1 C15.2 C16.1 R19.1 U1.4(VSS) X5.1
VDDA: C15.1 R18.2 U1.8(VDD) VD1.2(K)
ZERO: R4.2 U1.6(VINB-) U1.7(VOUTB)
SIN_C: R1.1 ; port SIN_C
U_RX: C9.2 R13.2 ; port U_RX
NetC1_1: C1.1 X5.2 ; port + RX_COIL
NetC1_2: C1.2 R3.2
NetC2_2: C2.2 R1.2 R5.1
NetC5_1: C5.1 R6.2
NetC7_1: C7.1 R9.2 R13.1 U1.1(VOUTA)
NetC7_2: C7.2 R5.2 R6.1 R9.1 U1.2(VINA-)
NetC16_2: C16.2 R18.1 R19.2 U1.5(VINB+)
NetC35*_1: X5.4 ; port + TX_COIL
NetR3_1: R3.1 R4.1 U1.3(VINA+) VD1.1(A)

### Library data of the parts
C1 C2 C5 C7 C9 C15 C16 = Capacitor SMD: Capacitor; Published: 8-Jun-2000; LatestRevisionDate: 17-Jul-2002; LatestRevisionNote: Re-released for DXP Platform.; PackageReference: RAD-0.3; Publisher: Altium Limited
  C1: Value: 0.1uF
  C2 C9: Value: 4700
  C5: Value: 0.033
  C7: Value: 22pF
  C15: Value: 1.0uF
  C16: Value: 10uF
R1 R3-R6 R9 R13 R18 R19 = Resistor
  R1: Published: 8-Jun-2000; LatestRevisionDate: 17-Jul-2002; LatestRevisionNote: Re-released for DXP Platform.; PackageReference: AXIAL-0.4; Publisher: Altium Limited; PackageDescription: Axial Device, Thru-Hole; 2 Leads; 0.4 in Pin Spacing; Value: 2K
  R3: Published: 31-Aug-2014; Publisher: Dmitry Kuzmin; Value: 100
  R4: Published: 8-Jun-2000; LatestRevisionDate: 17-Jul-2002; LatestRevisionNote: Re-released for DXP Platform.; PackageReference: AXIAL-0.4; Publisher: Altium Limited; PackageDescription: Axial Device, Thru-Hole; 2 Leads; 0.4 in Pin Spacing; Value: 2K0
  R5 R9: Published: 31-Aug-2014; Publisher: Dmitry Kuzmin; Value: 100K
  R6: Published: 31-Aug-2014; Publisher: Dmitry Kuzmin; Value: 1K2
  R13: Published: 31-Aug-2014; Publisher: Dmitry Kuzmin; Value: 2K
  R18 R19: Published: 31-Aug-2014; Publisher: Dmitry Kuzmin; Value: 10K
U1 = MCP6022-I/SN: Rail-to-Rail Input/Output, 10 MHz Operational Amplifier, 8-Pin SOIC, Industrial Temperature; Published: 29-Jan-2009; LatestRevisionDate: 02-Dec-2009; LatestRevisionNote: Updated to datasheet revision D, Feb-2009; DatasheetVersion: revD, Feb-2009; PackageVersion: revBB, Aug-2009; PackageReference: SOIC-SN8; Publisher: Altium Limited; PackageDescription: 8-Lead Plastic Small Outline (SN) - Narrow, 3.90mm Body [SOIC]; Supplier 1: Digi-Key; Supplier Part Number 1: MCP6022-I/SN-ND; Supplier 2: Farnell; Supplier Part Number 2: 1439415; Code_JEDEC: MS-012; Code_IPC: SOIC127P600-8; ComponentLink1Description: Datasheet; ComponentLink1URL: http://ww1.microchip.com/downloads/en/DeviceDoc/21685d.pdf; ComponentLink2Description: Packaging Specification; ComponentLink2URL: http://www.microchip.com/stellent/groups/techpub_sg/documents/packagingspec/en012702.pdf; ComponentLink3Description: Microchip.com Home; ComponentLink3URL: http://www.microchip.com/
VD1 = 1N4148: High Conductance Fast Diode; Published: 8-Jun-2000; LatestRevisionDate: 17-Jul-2002; LatestRevisionNote: Re-released for DXP Platform.; DatasheetDocument: 1997; PackageReference: DO-35; Publisher: Altium Limited; Code_JEDEC: DO-204-AH; ComponentLink1Description: Manufacturer Link; ComponentLink1URL: http://www.fairchildsemi.com/; ComponentLink2Description: Datasheet; ComponentLink2URL: http://www.fairchildsemi.com/ds/1N%2F1N4148.pdf
X5 = Jack 5p: Jack, 5 pin; LatestRevisionDate: 17-Jul-2002; LatestRevisionNote: Re-released for DXP Platform.; Publisher: Altium Limited

## Sheet Keyboard_on_board.SchDoc
size A4
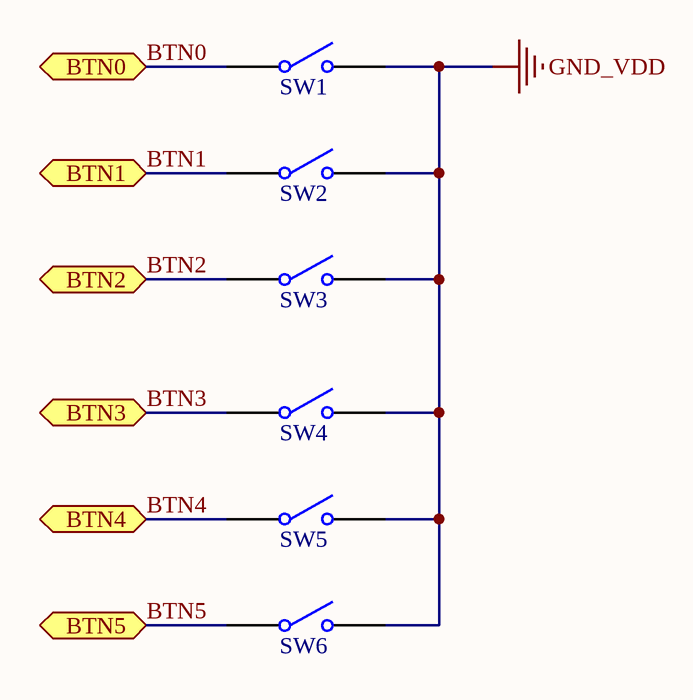
[diagram p5: Keyboard_on_board.SchDoc]

### Parts
SW1  "OK"  [KAN1211]  (value not drawn)
SW2  "Right"  [KAN1211]  (value not drawn)
SW3  "Down"  [KAN1211]  (value not drawn)
SW4  "Up"  [KAN1211]  (value not drawn)
SW5  "Left"  [KAN1211]  (value not drawn)
SW6  "Menu / Esc"  [KAN1211]  (value not drawn)

### Ports
BTN0 (bidir), BTN1 (bidir), BTN2 (bidir), BTN3 (bidir), BTN4 (bidir), BTN5 (bidir)

### Nets
GND_VDD: SW1.2(NO) SW2.2(NO) SW3.2(NO) SW4.2(NO) SW5.2(NO) SW6.2(NO)
BTN0: SW1.1(COMMON) ; port BTN0
BTN1: SW2.1(COMMON) ; port BTN1
BTN2: SW3.1(COMMON) ; port BTN2
BTN3: SW4.1(COMMON) ; port BTN3
BTN4: SW5.1(COMMON) ; port BTN4
BTN5: SW6.1(COMMON) ; port BTN5

### Library data of the parts
SW1-SW6 = TACT Switch: Single-Pole, Single-Throw Switch; Published: 24-Mar-1999; LatestRevisionDate: 17-Jul-2002; LatestRevisionNote: Re-released for DXP Platform.; PackageReference: SPST-2; Publisher: Altium Limited; PackageDescription: Switch; 2 Leads

## Sheet Integrator.SchDoc
size A4
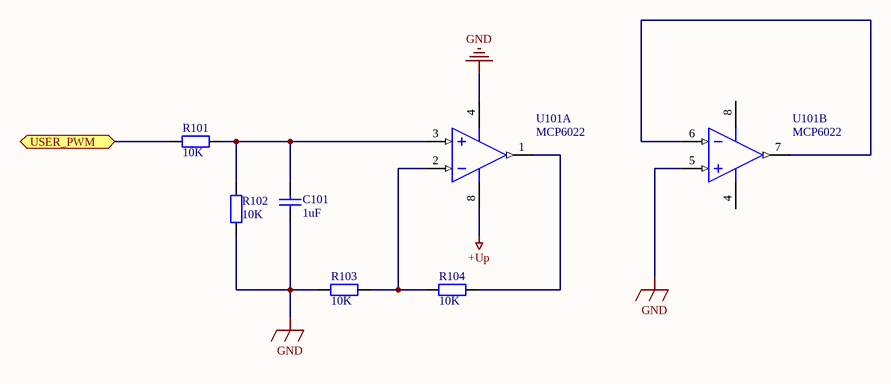
[diagram p6: Integrator.SchDoc]

### Parts
C101  1uF  [0805]
R101  10K  [1206_SMD_Resistor]
R102  10K  [1206_SMD_Resistor]
R103  10K  [1206_SMD_Resistor]
R104  10K  [1206_SMD_Resistor]
U101  MCP6022  [SOIC-SN8_N]  (parts A,B of 2)

### Ports
USER_PWM

### Nets
+Up: U101.8(VDD)
GND: C101.1 R102.1 R103.1 U101.4(VSS) U101.5(VINB+)
NetC101_2: C101.2 R101.2 R102.2 U101.3(VINA+)
NetR47_1: R101.1 ; port USER_PWM
NetR103_2: R103.2 R104.1 U101.2(VINA-)
NetR104_2: R104.2 U101.1(VOUTA)
NetU101_6: U101.6(VINB-) U101.7(VOUTB)

### Library data of the parts
C101 = Capacitor SMD: Capacitor; Published: 8-Jun-2000; LatestRevisionDate: 17-Jul-2002; LatestRevisionNote: Re-released for DXP Platform.; PackageReference: RAD-0.3; Publisher: Altium Limited; Value: 1uF
R101-R104 = Resistor: Published: 31-Aug-2014; Publisher: Dmitry Kuzmin; Value: 10K
U101 = MCP6022-I/SN: as U1 on sheet ReceiverBlock; Published: 29-Jan-2009; LatestRevisionDate: 02-Dec-2009; LatestRevisionNote: Updated to datasheet revision D, Feb-2009; DatasheetVersion: revD, Feb-2009; PackageVersion: revBB, Aug-2009; PackageReference: SOIC-SN8; Publisher: Altium Limited; PackageDescription: 8-Lead Plastic Small Outline (SN) - Narrow, 3.90mm Body [SOIC]; Supplier 1: Digi-Key; Supplier Part Number 1: MCP6022-I/SN-ND; Supplier 2: Farnell; Supplier Part Number 2: 1439415; Code_JEDEC: MS-012; Code_IPC: SOIC127P600-8; ComponentLink1Description: Datasheet; ComponentLink1URL: http://ww1.microchip.com/downloads/en/DeviceDoc/21685d.pdf; ComponentLink2Description: Packaging Specification; ComponentLink2URL: http://www.microchip.com/stellent/groups/techpub_sg/documents/packagingspec/en012702.pdf; ComponentLink3Description: Microchip.com Home; ComponentLink3URL: http://www.microchip.com/

## Nets that join several sheets
+5V: Power block (5 pins), Transmitter (8 pins)
+Up: Microcontroller block (R31.1), Power block (14 pins), SoundBlock (C33.1 C34.1 U7.6), Integrator (U101.8)
GND: Power block (8 pins), SoundBlock (C30.1 C33.2 C34.2 U7.7), ReceiverBlock (X5.3), Integrator (5 pins)
GND_5V: Power block (7 pins), Transmitter (8 pins), ReceiverBlock (X5.5)
GND_VDD: Microcontroller block (22 pins), Power block (10 pins), SoundBlock (9 pins), Keyboard_on_board (6 pins)
GND_VDDA: Microcontroller block (U2.8), Power block (5 pins), ReceiverBlock (8 pins)
VDD: Microcontroller block (11 pins), Power block (7 pins), SoundBlock (U10.4 U10.10)
VDDA: Microcontroller block (U2.9), Power block (C18.2 C20.2 L1.2), ReceiverBlock (C15.1 R18.2 U1.8 VD1.2)
VLCD: Microcontroller block (J1.2), Power block (C39.2 J2.2 U9.2 U9.4)
BTN0: Microcontroller block (U2.46), Keyboard_on_board (SW1.1)
BTN1: Microcontroller block (U2.45), Keyboard_on_board (SW2.1)
BTN2: Microcontroller block (U2.43), Keyboard_on_board (SW3.1)
BTN3: Microcontroller block (U2.42), Keyboard_on_board (SW4.1)
BTN4: Microcontroller block (U2.41), Keyboard_on_board (SW5.1)
BTN5: Microcontroller block (U2.40), Keyboard_on_board (SW6.1)
I_TX: Microcontroller block (U2.19), Transmitter (C8.2 R8.1)
NetC19_2: Microcontroller block (U2.11), Power block (C19.2 R20.2 R21.2)
NetC31_1: Microcontroller block (U2.14), SoundBlock (C31.1 R49.1)
NetC35*_1: Transmitter (C35*.1), ReceiverBlock (X5.4)
NetR22_2: Microcontroller block (R22.2 U2.3 U4.6), SoundBlock (U10.14)
NetR23_1: Microcontroller block (R23.1 U2.2 U4.5), SoundBlock (U10.13)
NetR47_1: Microcontroller block (U2.13), Power block (R47.1), Integrator (R101.1)
NetU2_4: Microcontroller block (U2.4), SoundBlock (U7.1 U10.8)
SIN_C: Microcontroller block (U2.15), ReceiverBlock (R1.1)
TX: Microcontroller block (U2.21), Transmitter (R17.2)
U_RX: Microcontroller block (U2.17), ReceiverBlock (C9.2 R13.2)

## Assembly variants
С питание LCD от 3.3В: not fitted C35* C38 U9 X8